# EAGLE schematic sampling (EAGLE 9.6.1)
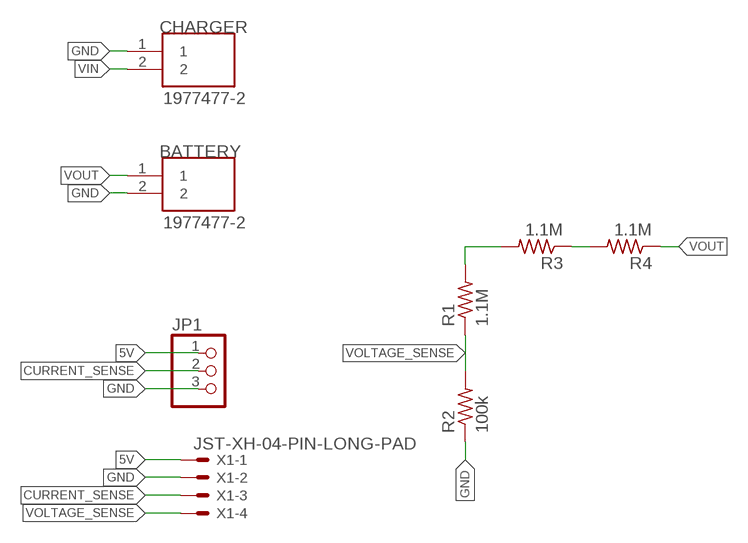
[diagram p0: schematic, sheet 1]

## Parts
BATTERY  1977477-2  [TE_1977477-2]
CHARGER  1977477-2  [TE_1977477-2]
JP1  PINHD-1X3  [1X03]
R1  1.1M  R-US_R0805  [R0805]
R2  100k  R-US_R0805  [R0805]
R3  1.1M  R-US_R0805  [R0805]
R4  1.1M  R-US_R0805  [R0805]
X1  JST-XH-04-PIN-LONG-PAD  [JST-XH-04-PACKAGE-LONG-PAD]

## Nets
5V: JP1.1 X1.1
CURRENT_SENSE: JP1.2 X1.3
GND: BATTERY.2 CHARGER.1 JP1.3 R2.1 X1.2
N$1: R1.2 R3.2
N$2: R3.1 R4.2
VIN: CHARGER.2
VOLTAGE_SENSE: R1.1 R2.2 X1.4
VOUT: BATTERY.1 R4.1

## Library data of the parts
BATTERY CHARGER = terminal_block_TA:1977477-2: Check availability <https://pricing.snapeda.com/parts/1977477-2/TE%20Connectivity/view-part?ref=eda>; AVAILABILITY: In Stock; COMMENT: 1977477-2; DESCRIPTION: Conn Barrier Strip 2 POS 8.25mm Solder ST Thru-Hole 15A/Contact Carton; MF: TE Connectivity; MP: 1977477-2; PACKAGE: None; PRICE: None; PURCHASE-URL: https://pricing.snapeda.com/search/part/1977477-2/?ref=eda
JP1 = pinhead:PINHD-1X3: PIN HEADER
R1-R4 = rcl:R-US_: RESISTOR, American symbol; SPICEPREFIX: R
X1 = Rembrandt Electronics - JST XH Connectors v1-0:JST-XH-04-PIN: JST XH Connector 2 Pin Wire to board connector. Pitch: 2,54 mm, (0.100") Number of pins: 4 Created by Rembrandt Electronics www.rembrandtelectronics.com